# EAGLE design shinobi_5v_3V3 (EAGLE 8.2.2)
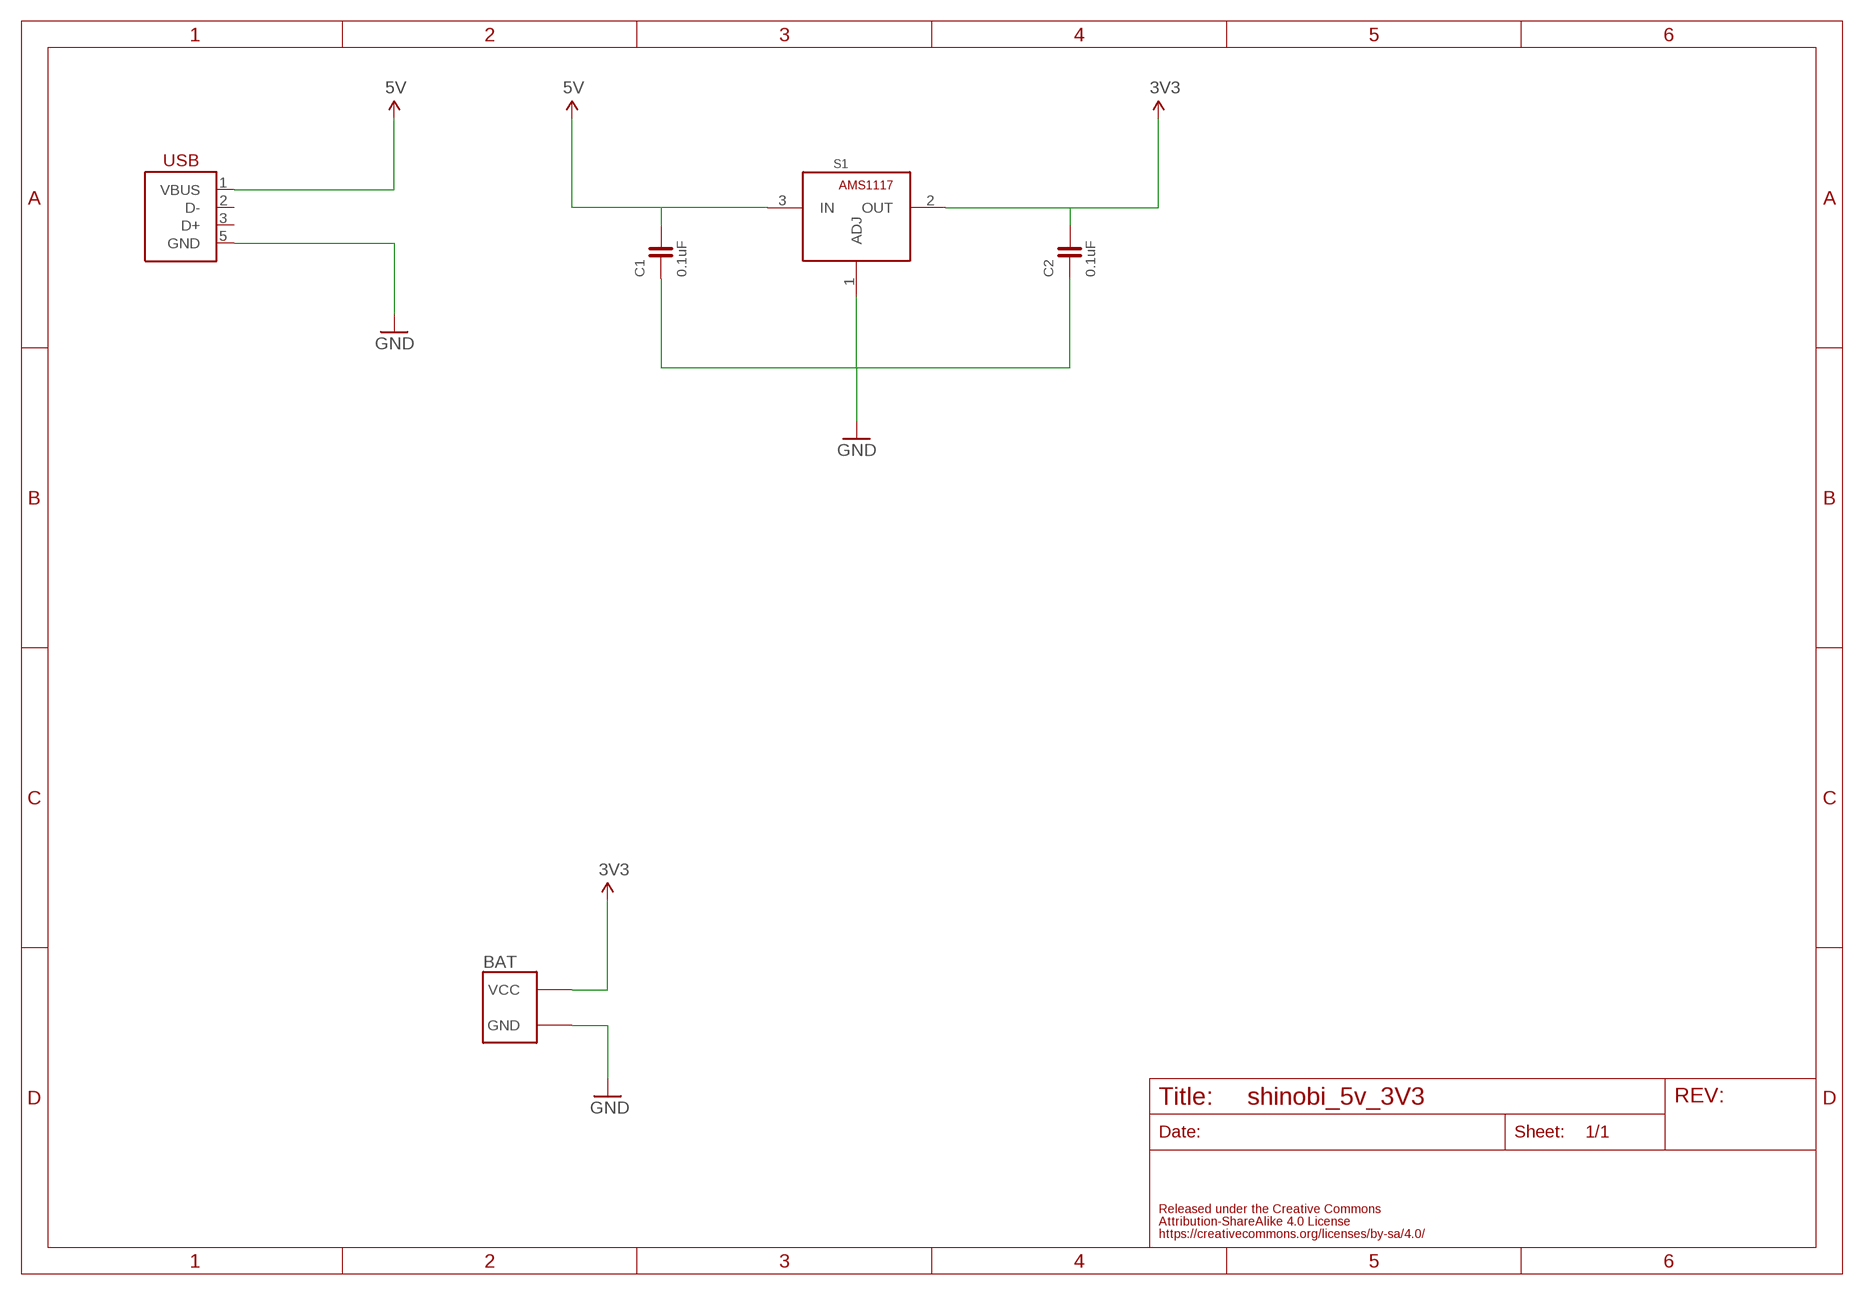
[diagram p0: schematic, sheet 1]

## Parts
BAT  FABO_BRICK_2PIN_SIDE  [FABO_BRICK_2PIN_S02B−PASK-2_SILK]
C1  0.1uF  CAPACITOR-0603  [0603]
C2  0.1uF  CAPACITOR-0603  [0603]
S1  AMS1117  [SOT-223-3]
USB1  USB-MICRO_B_SMT_HIROSE  [ZX62R-B-5P]

## Nets
3V3: BAT.VCC C2.2 S1.2(OUT)
5V: C1.2 S1.3(IN) USB1.1(VBUS)
GND: BAT.GND C1.1 C2.1 S1.1(ADJ) USB1.5(GND)
Unconnected: USB1.2(D-) USB1.3(D+)

## Library data of the parts
BAT = FaBo-Template:FABO_BRICK_2PIN
C1 C2 = FaBo-Capacitor:CAPACITOR: CAPACITOR
S1 = FaBo-Supply:AMS1117
USB1 = FaBo-USB:USB

## Board
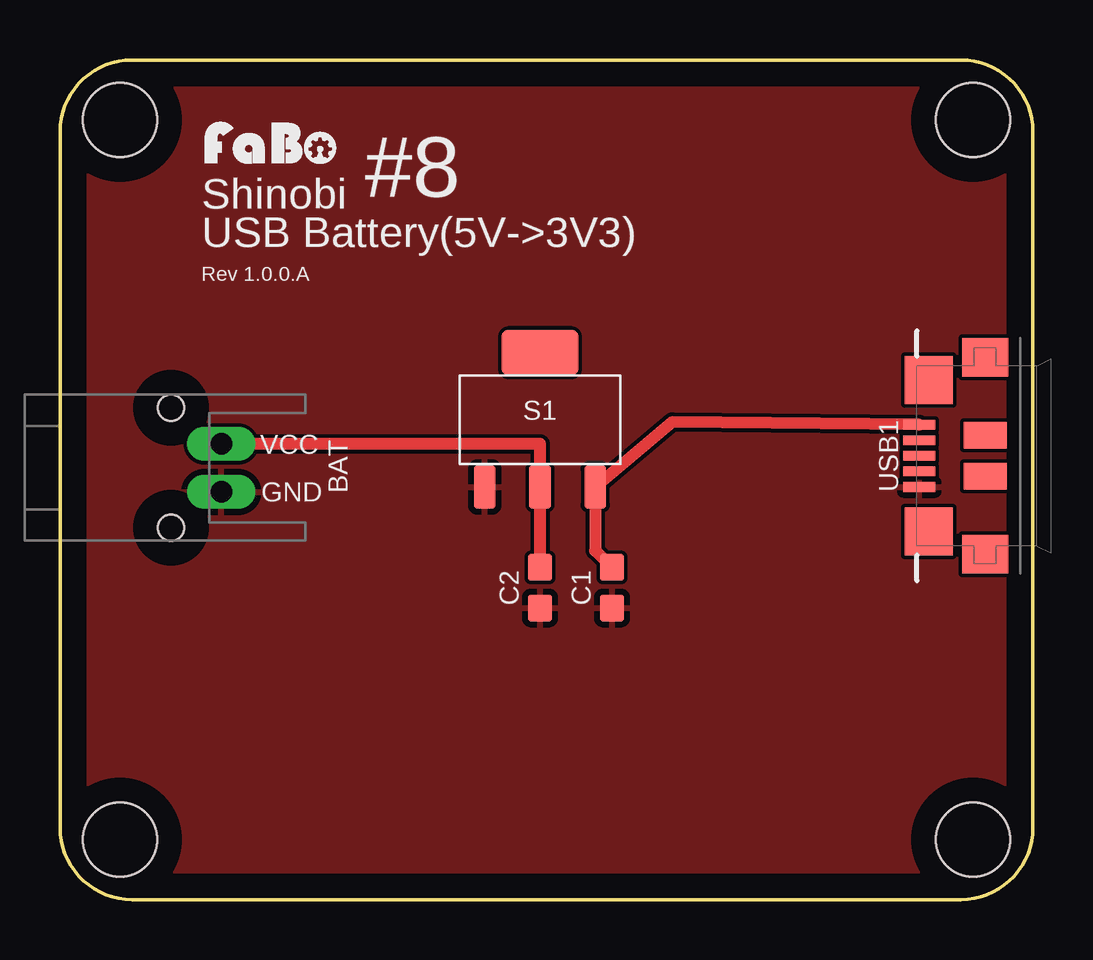
[diagram p1: board, top side]
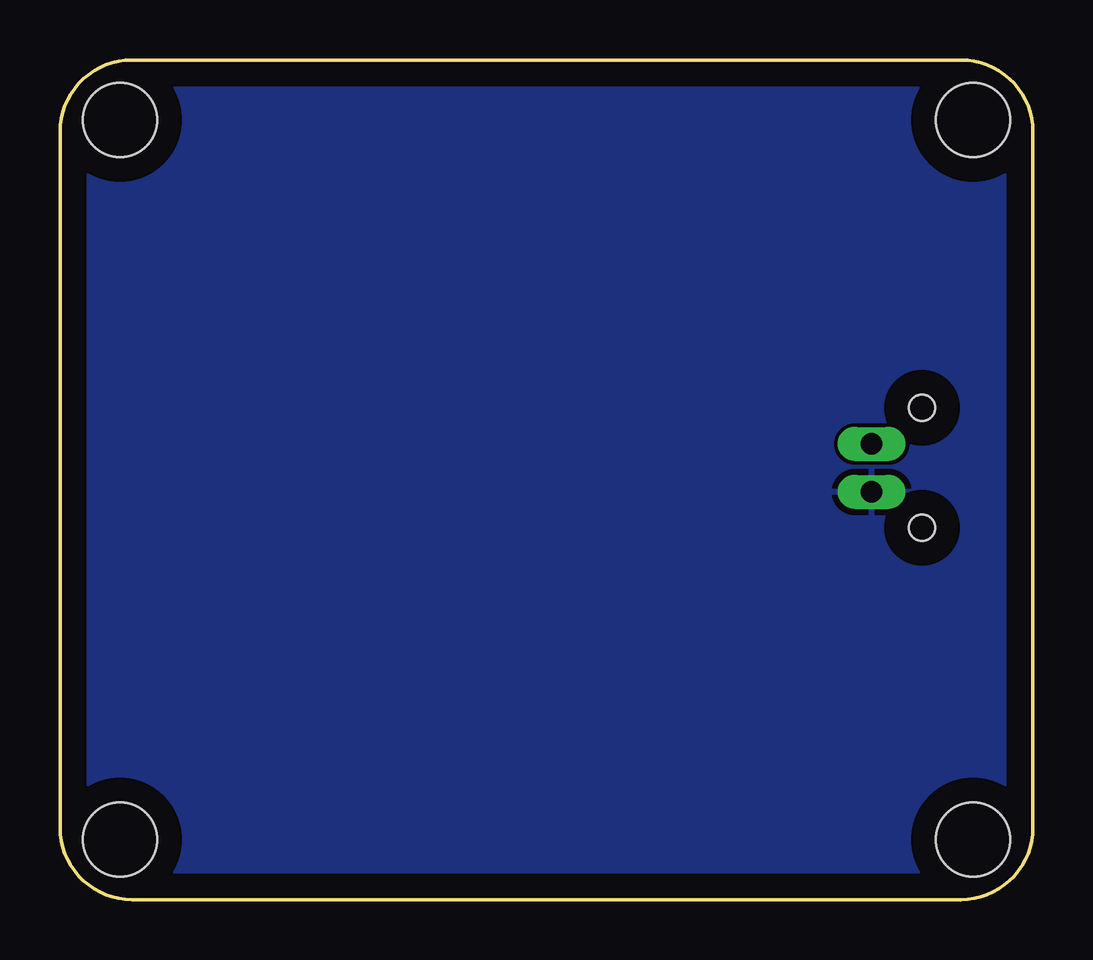
[diagram p2: board, bottom side, seen from below]

Size 40.54 x 35 mm. Coordinates in mm from the lower left corner, seen from the top.
Copper layers (1*16): Top 0.035mm / dielectric 1.5mm / Bottom 0.035mm
Design rules "default": minimum track width 6mil, minimum drill 0.35mm, track to track 6mil, track to pad 6mil, pad to pad 6mil, via to via 6mil, smd to smd 6mil, copper to edge 40mil, drill to drill 6mil, minimum pad ring 10mil, minimum via ring 8mil, stop-mask expansion 4mil, vias tented up to drill 0mil, thermal gap 10mil

### Footprints (pad centres in the part's own frame; a part is rotated, then mirrored left to right if it is on the bottom)
FABO_BRICK_2PIN_S02B−PASK-2_SILK = drill 0.9 pad 1.422 long: GND -1,-0.102; VCC 1,-0.102 | hole 1.1: 2.5,1.998; -2.5,1.998
0603 = smd 1.1 x 1: 1 -0.85,0; 2 0.85,0
SOT-223-3 = smd 0.9 x 1.8: 1 -2.3,-2.8; 2 0,-2.8; 3 2.3,-2.8 | smd 3.2 x 1.9: 4 0,2.8
FABO-SHINOBI = hole 3.1: 2.5,32.5; 38.04,32.5; 38.04,2.5; 2.5,2.5
ZX62R-B-5P = smd 0.4 x 1.35: 1 1.3,4.2; 2 0.65,4.2; 3 0,4.2; 4 -0.65,4.2; 5 -1.3,4.2 | smd 2 x 2: 6 3.15,3.8; 7 -3.15,3.8 | smd 1.6 x 1.9: 8 4.1,1.45; 11 -4.1,1.45 | smd 1.1 x 1.8: 9 0.85,1.45; 10 -0.85,1.45

### Placement (x,y rotation side)
BAT  6.62,18 90 top
C1  23,13 90 top
C2  20,13 90 top
S1  20,20 0 top
U$2  [LOGO_FABO_S]  8.83,30.52 0 top
U$3  [FABO-SHINOBI]  0,0 0 top
USB1  40,18.5 90 top

### Tracks (layer width: path | path; a pad name or v marks a point on that pad's centre or on a via)
3V3
  Top 0.508: C2.2 S1.2 20,19 BAT.VCC
5V
  Top 0.508: USB1.1 25.5,19.9 S1.3 22.3,14.55 C1.2
GND
  pour Bottom: 0,0 41,0 41,35 0,35
  pour Top: 0,0 41,0 41,35 0,35

### Text on the board
tPlace: Shinobi | #8 | USB Battery(5V->3V3) | Rev 1.0.0.A